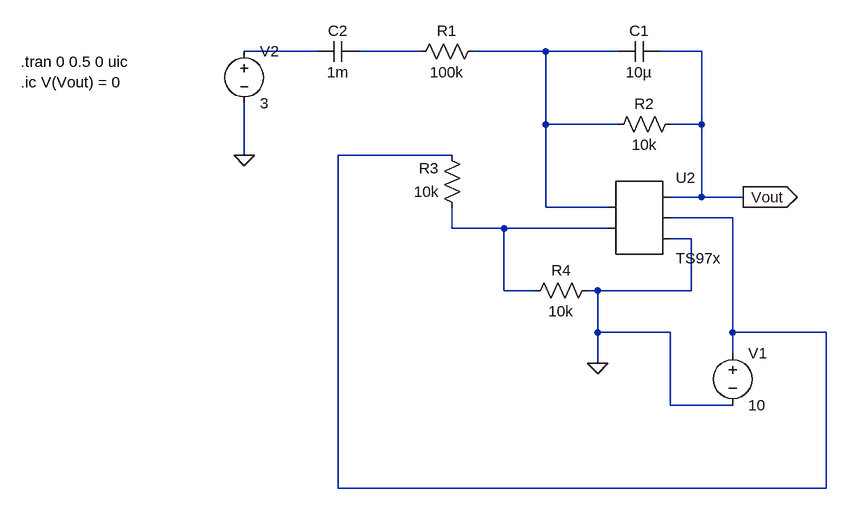
[diagram p0: schematic single_supply_integrator.asc]
single_supply_integrator.asc, the LTspice schematic file:
Version 4
SHEET 1 880 692
WIRE -80 16 -192 16
WIRE 80 16 -16 16
WIRE 272 16 160 16
WIRE 384 16 272 16
WIRE 512 16 448 16
WIRE 272 128 272 16
WIRE 384 128 272 128
WIRE 512 128 512 16
WIRE 512 128 464 128
WIRE -192 176 -192 96
WIRE 128 176 -48 176
WIRE 512 240 512 128
WIRE 512 240 464 240
WIRE 576 240 512 240
WIRE 272 256 272 128
WIRE 368 256 272 256
WIRE 560 272 464 272
WIRE 128 288 128 256
WIRE 208 288 128 288
WIRE 368 288 208 288
WIRE 496 304 464 304
WIRE 208 384 208 288
WIRE 256 384 208 384
WIRE 352 384 336 384
WIRE 496 384 496 304
WIRE 496 384 352 384
WIRE 352 448 352 384
WIRE 464 448 352 448
WIRE 560 448 560 272
WIRE 704 448 560 448
WIRE 560 480 560 448
WIRE 352 496 352 448
WIRE 464 560 464 448
WIRE 560 560 464 560
WIRE -48 688 -48 176
WIRE 704 688 704 448
WIRE 704 688 -48 688
FLAG 352 496 0
FLAG 576 240 Vout
IOPIN 576 240 Out
FLAG -192 176 0
SYMBOL voltage 560 464 R0
SYMATTR InstName V1
SYMATTR Value 10
SYMATTR SpiceLine Rser=0
SYMBOL res 64 32 R270
WINDOW 0 32 56 VTop 2
WINDOW 3 0 56 VBottom 2
SYMATTR InstName R1
SYMATTR Value 100k
SYMBOL res 368 144 R270
WINDOW 0 32 56 VTop 2
WINDOW 3 0 56 VBottom 2
SYMATTR InstName R2
SYMATTR Value 10k
SYMBOL res 144 272 R180
WINDOW 0 36 76 Left 2
WINDOW 3 36 40 Left 2
SYMATTR InstName R3
SYMATTR Value 10k
SYMBOL res 352 368 R90
WINDOW 0 0 56 VBottom 2
WINDOW 3 32 56 VTop 2
SYMATTR InstName R4
SYMATTR Value 10k
SYMBOL AutoGenerated/TS97x 416 272 R0
SYMATTR InstName U2
SYMBOL voltage -192 0 R0
SYMATTR InstName V2
SYMATTR Value 3
SYMATTR SpiceLine Rser=0
SYMBOL cap 384 32 R270
WINDOW 0 32 32 VTop 2
WINDOW 3 0 32 VBottom 2
SYMATTR InstName C1
SYMATTR Value 10µ
SYMBOL cap -16 0 R90
WINDOW 0 0 32 VBottom 2
WINDOW 3 32 32 VTop 2
SYMATTR InstName C2
SYMATTR Value 1m
TEXT -536 32 Left 2 !.tran 0 0.5 0 uic\n.ic V(Vout) = 0

The netlist it stands for:
* single_supply_integrator.asc
V1 N004 0 10 Rser=0
R1 N002 N003 100k
R2 N003 Vout 10k
R3 N005 N004 10k
R4 0 N005 10k
* U2: TS97x (symbol AutoGenerated/TS97x not available, pins judged from their places): pin1=N003 pin2=N005 pin3=Vout pin4=N004 pin5=0
V2 N001 0 3 Rser=0
C1 N003 Vout 10µ
C2 N002 N001 1m
.tran 0 0.5 0 uic
.ic V(Vout) = 0
.backanno
.end